# EAGLE design Battery Control (EAGLE 8.4.1)
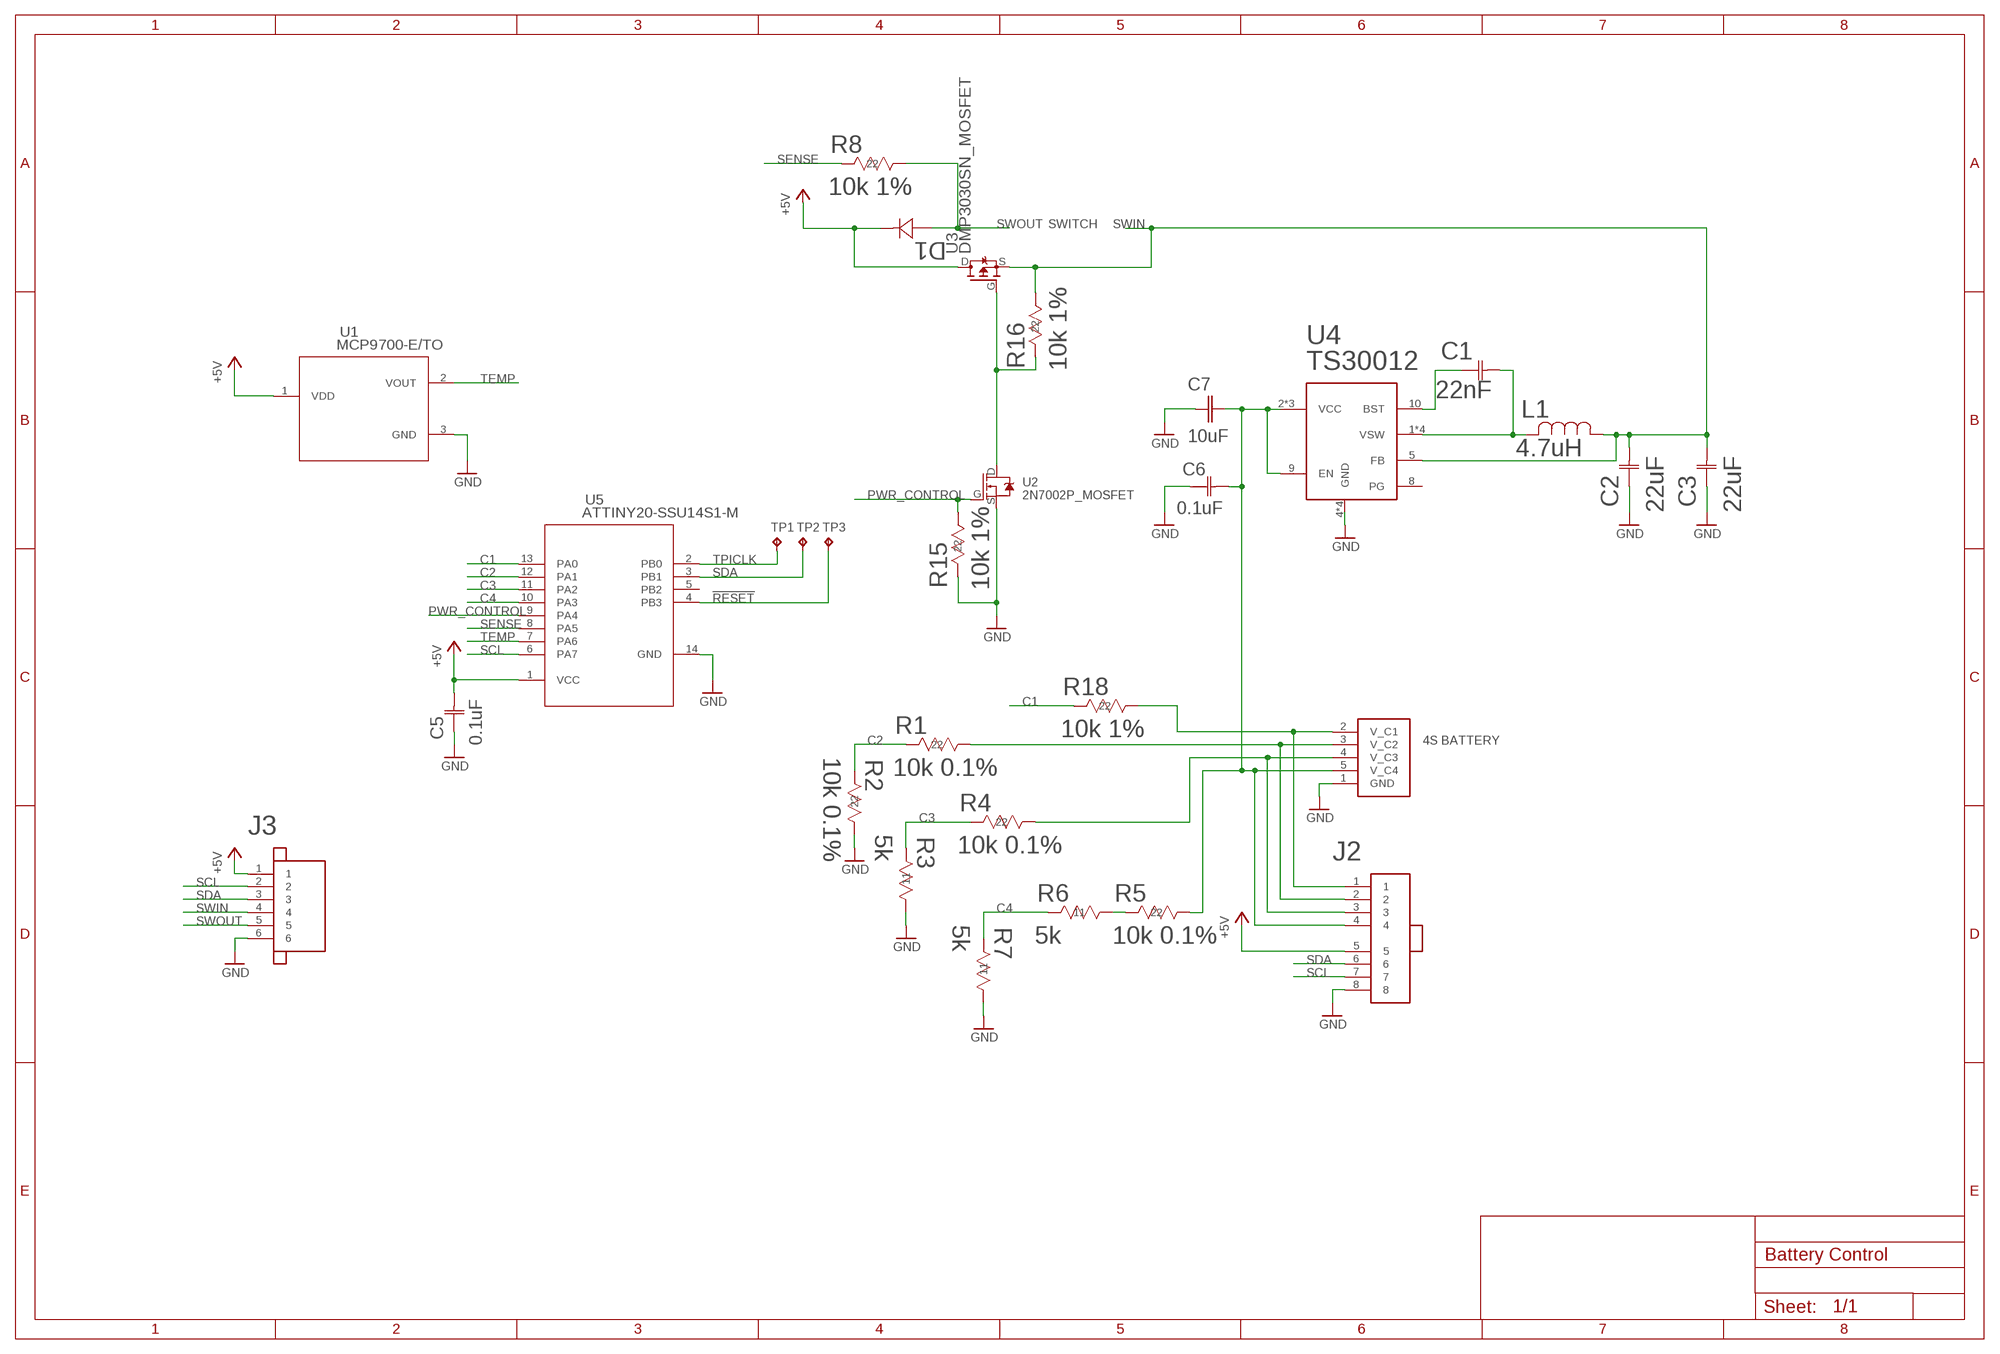
[diagram p0: schematic, sheet 1]

## Parts
C1  22nF  GRM155R71H223KA12DG-155-M  [G-155-M]
C2  22uF  GRM21BR60J226ME39L  [G-21]
C3  22uF  GRM21BR60J226ME39L  [G-21]
C5  0.1uF  08055C104KAT2A  [0805]
C6  0.1uF  08055C104KAT2A  [0805]
C7  10uF  10UF_CAPACITOR  [1206_MLCC]
D1  1N4148W-7-FSOD123-M  [SOD123-M]
J1  JST-XH_5POS  [JST-XH_5POS]
J2  SPRING_BTB_8POS_FEMALE  [SPRING_BTB_8POS_FEMALE]
J3  JST_SH_6POS_SIDE  [JST_SH_6POS_SIDE]
L1  4.7uH  DFE252012P-4R7M=P2"  [1008]
R1  10k 0.1%  ERA-6AEB103V  [RC0805N]
R2  10k 0.1%  ERA-6AEB103V  [RC0805N]
R3  5k  PNM0402E5001BST1  [0402]
R4  10k 0.1%  ERA-6AEB103V  [RC0805N]
R5  10k 0.1%  ERA-6AEB103V  [RC0805N]
R6  5k  PNM0402E5001BST1  [0402]
R7  5k  PNM0402E5001BST1  [0402]
R8  10k 1%  ERA-6AEB103V  [RC0805N]
R15  10k 1%  ERA-6AEB103V  [RC0805N]
R16  10k 1%  ERA-6AEB103V  [RC0805N]
R18  10k 1%  ERA-6AEB103V  [RC0805N]
TP1  TPB2,54  [B2,54]
TP2  TPB2,54  [B2,54]
TP3  TPB2,54  [B2,54]
U1  MCP9700-E/TO  [TO-92_MC]
U2  2N7002P_MOSFET  [SOT-23_(TO-236AB)]
U3  DMP3030SN_MOSFET  [SC59_MOSFET]
U4  TS30012  [16-VQFN]
U5  ATTINY20-SSU14S1-M  [14S1-M]

## Nets
!RESET: TP3.TP U5.4(PB3)
+5V: C5.2 D1.C J2.5 J3.1 U1.1(VDD) U3.D U5.1(VCC)
C1: R18.2 U5.13(PA0)
C2: R1.2 R2.2 U5.12(PA1)
C3: R3.1 R4.2 U5.11(PA2)
C4: R6.1 R7.1 U5.10(PA3)
GND: C2.1 C3.1 C5.1 C6.1 C7.P$1 J1.1(GND) J2.8 J3.6 R2.1 R3.2 R7.2 R15.2 U1.3(GND) U2.S U4.4(GND) U4.14(GND) U4.15(GND) U4.17(GND) U5.14(GND)
N$1: R16.2 U2.D U3.G
N$2: C1.1 U4.10(BST)
N$3: C1.2 L1.P$2 U4.1(VSW) U4.12(VSW) U4.13(VSW) U4.16(VSW)
N$8: J1.2(V_C1) J2.1 R18.1
N$10: J1.3(V_C2) J2.2 R1.1
N$13: J1.4(V_C3) J2.3 R4.1
N$14: R5.2 R6.2
N$16: C6.2 C7.P$2 J1.5(V_C4) J2.4 R5.1 U4.2(VCC) U4.3(VCC) U4.9(EN) U4.11(VCC)
PWR_CONTROL: R15.1 U2.G U5.9(PA4)
SCL: J2.7 J3.2 U5.6(PA7)
SDA: J2.6 J3.3 TP2.TP U5.3(PB1)
SENSE: R8.2 U5.8(PA5)
SWIN: C2.2 C3.2 J3.4 L1.P$1 R16.1 U3.S U4.5(FB)
SWOUT: D1.A J3.5 R8.1
TEMP: U1.2(VOUT) U5.7(PA6)
TPICLK: TP1.TP U5.2(PB0)
Unconnected: U4.8(PG) U5.5(PB2)

## Notes on the sheet
- SWITCH

## Library data of the parts
C1 = 22nF-capacitor:GRM155R71H223KA12D; MANUFACTURER_PART_NUMBER: GRM155R71H223KA12D; VENDOR: Murata
C2 C3 = 22uF X5R Ceramic Capacitor:GRM21BR60J226ME39L; COPYRIGHT: Copyright C 2015 Accelerated Designs. All rights reserved; MANUFACTURER_PART_NUMBER: GRM21BR60J226ME39L; VENDOR: Vendor
C5 C6 = 0.1uF X7R Ceramic Capacitor:08055C104KAT2A; COPYRIGHT: Copyright C 2015 Accelerated Designs. All rights reserved; MANUFACTURER_PART_NUMBER: 08055C104KAT2A; VENDOR: Vendor
C7 = thanics_robotics:10UF_CAPACITOR
D1 = 1n4148w-diode:1N4148W-7-F; COPYRIGHT: Copyright C 2015 Accelerated Designs. All rights reserved; MANUFACTURER_PART_NUMBER: 1N4148W7F; VENDOR: Diodes Inc
J1 = thanics_robotics:JST-XH_5POS
J2 = thanics_robotics:SPRING_BTB_8POS_FEMALE
J3 = thanics_robotics:JST_SH_6POS_SIDE
L1 = 4.7uH-inductor:DFE252012P-4R7M=P2
R1 R2 R4 R5 R8 R15 R16 R18 = 10k-resistor:ERA-6AEB103V; CASE: 0805 2012 metric; COMPOSITION: Thin Film; COPYRIGHT: Copyright C 2015 Accelerated Designs. All rights reserved; DATASHEET: httpindustrial.panasonic.comwwwcgijvcr13pz.cgi?E+PZ+3+AOA0026+ERA6AEB103V+7+WW; DIGIKEYPARTNUMBER: P10KDATRND; HEIGHT: 0.024" 0.60mm; LEADSTYLE: Surface Mount SMD SMT; MANUFACTURER_PART_NUMBER: ERA6AEB103V; NUMBEROFTERMINATIONS: 2; PACKAGECASE: 0805 2012 Metric; PACKAGING: Tape &amp Reel TR; POWERWATTS: 0.125W 18W; QUANTITY_AVAILABLE: 225000; RESISTANCEINOHMS: 10.0K; RESISTANCEOHMS: 10K; SIZEDIMENSION: 0.079" L x 0.049" W 2.00mm x 1.25mm; TEMPERATURECOEFFICIENT: 25ppm°C; TOLERANCE: 0.1%; VENDOR: Panasonic; VOLTAGEWORKING: 100V
R3 R6 R7 = 5k-resistor:PNM0402E5001BST1; COPYRIGHT: Copyright C 2015 Accelerated Designs. All rights reserved; MANUFACTURER_PART_NUMBER: PNM0402E5001BST1; VENDOR: Vendor
TP1-TP3 = testpad:TP: Test pad
U1 = mcp9700-temp:MCP9700-E/TO; MANUFACTURER_PART_NUMBER: MCP9700ETO; VENDOR: Microchip
U2 = thanics_robotics:2N7002P_MOSFET
U3 = thanics_robotics:DMP3030SN_MOSFET
U4 = thanics_robotics:TS30012
U5 = attiny20:ATTINY20-SSU; MANUFACTURER_PART_NUMBER: ATTINY20SSU; VENDOR: Atmel

## Board
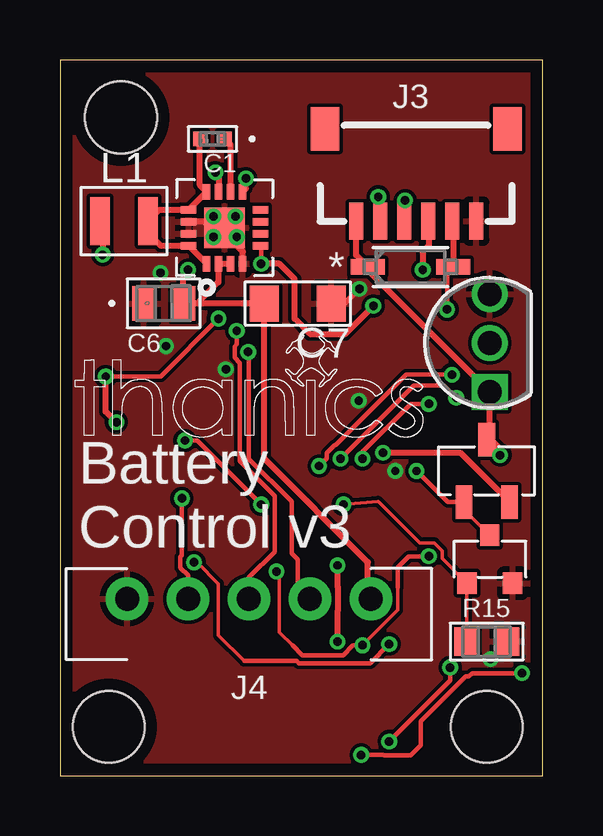
[diagram p1: board, top side]
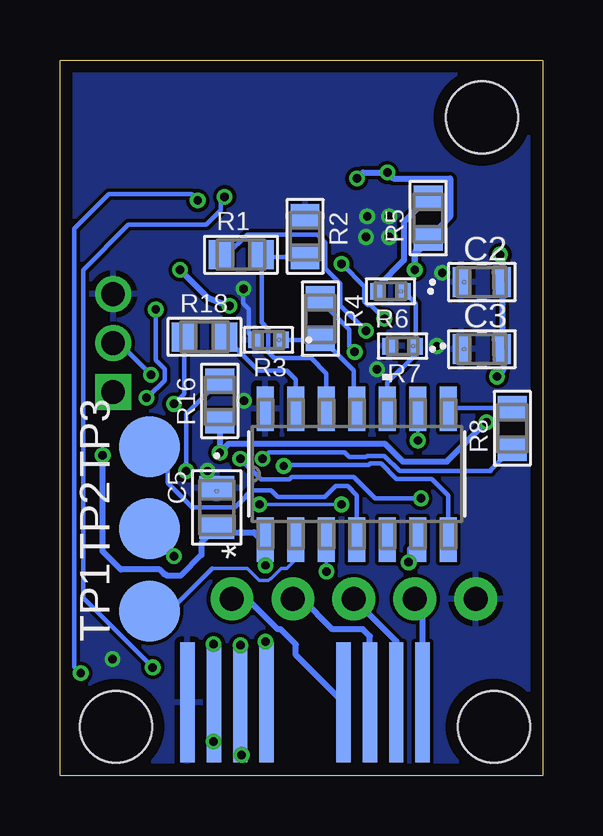
[diagram p2: board, bottom side, seen from below]

Size 20.12 x 29.84 mm. Coordinates in mm from the lower left corner, seen from the top.
Outline: 0,0 20.12,0 20.12,29.84 0,29.84 0,0
Copper layers (1*16): Top 0.035mm / dielectric 1.6mm / Bottom 0.035mm
Design rules "Elecrow_2-layer_PCB_eagle_rule": minimum track width 6mil, minimum drill 12mil, track to track 6mil, track to pad 6mil, pad to pad 6mil, via to via 8mil, smd to smd 0mil, copper to edge 20mil, drill to drill 10mil, minimum pad ring 6mil, minimum via ring 6mil, stop-mask expansion 0mil, vias tented up to drill 100mil, thermal gap 10mil
Holes 3 mm at 17.78,2.03 2.03,2.03 2.54,27.43

### Footprints (pad centres in the part's own frame; a part is rotated, then mirrored left to right if it is on the bottom)
G-155-M = smd 0.559 x 0.61: 1 -0.521,0; 2 0.521,0
G-21 = smd 0.711 x 1.245: 1 -0.851,0; 2 0.851,0
0805 = smd 0.965 x 1.448: 1 -0.826,0; 2 0.826,0
1206_MLCC = smd 1.2 x 1.5: P$1 -1.4,0; P$2 1.4,0
SOD123-M = smd 1.416 x 0.652: A 1.776,0; C -1.776,0
JST-XH_5POS = drill 1 pad 1.778: 1 0,5.08; 2 0,2.54; 3 0,0; 4 0,-2.54; 5 0,-5.08
SPRING_BTB_8POS_FEMALE = smd 0.6 x 5: 1 -4.9,0; 2 -3.8,0; 3 -2.7,0; 4 -1.6,0; 5 1.6,0; 6 2.7,0; 7 3.8,0; 8 4.9,0
JST_SH_6POS_SIDE = smd 0.6 x 1.55: 1 -1.5,0; 2 -0.5,0; 3 0.5,0; 4 1.5,0; 5 2.5,0; 6 3.5,0 | smd 1.2 x 1.8: P$5 -2.8,3.85; P$6 4.8,3.85
1008 = smd 0.8 x 2: P$1 -1,0; P$2 1,0
RC0805N = smd 1.006 x 1.2: 1 -0.853,0; 2 0.853,0
0402 = smd 0.584 x 0.686: 1 -0.546,0; 2 0.546,0
B2,54 = smd 2.54 x 2.54: TP 0,0
TO-92_MC = drill 0.991 pad 1.499 square: 1 -3.31,0 | drill 0.991 pad 1.499: 2 -1.27,0; 3 0.77,0
SOT-23_(TO-236AB) = smd 0.8 x 0.9: D 0,-1; G 0.95,1; S -0.95,1
SC59_MOSFET = smd 0.7 x 1.4: D 0,1.3; G -0.95,-1.3; S 0.95,-1.3
16-VQFN = smd 0.3 x 0.65: 1 -0.75,-1.27; 2 -0.25,-1.27; 3 0.25,-1.27; 4 0.75,-1.27; 9 0.75,1.73; 10 0.25,1.73; 11 -0.25,1.73; 12 -0.75,1.73 | smd 0.65 x 0.3: 5 1.5,-0.52; 6 1.5,-0.02; 7 1.5,0.48; 8 1.5,0.98; 13 -1.5,0.98; 14 -1.5,0.48; 15 -1.5,-0.02; 16 -1.5,-0.52 | smd 1.7 x 1.7: 17 0,0.23
14S1-M = smd 1.854 x 0.711: 1 -2.731,3.81; 2 -2.731,2.54; 3 -2.731,1.27; 4 -2.731,0; 5 -2.731,-1.27; 6 -2.731,-2.54; 7 -2.731,-3.81; 8 2.731,-3.81; 9 2.731,-2.54; 10 2.731,-1.27; 11 2.731,0; 12 2.731,1.27; 13 2.731,2.54; 14 2.731,3.81

### Placement (x,y rotation side)
C1  6.35,26.54 180 top
C2  2.54,20.57 0 bottom
C3  2.54,17.78 0 bottom
C5  13.59,11.18 270 bottom
C6  4.32,19.69 0 top
C7  9.91,19.69 180 top
D1  14.61,21.21 0 top
J1  7.87,7.37 90 top
J2  9.91,3.05 180 bottom
J3  13.84,23.11 0 top
L1  2.67,23.11 0 top
R1  12.57,21.72 0 bottom
R2  9.91,22.48 270 bottom
R3  11.43,18.16 180 bottom
R4  9.27,19.05 270 bottom
R5  4.78,23.24 90 bottom
R6  6.35,20.19 180 bottom
R7  5.84,17.91 180 bottom
R8  1.27,14.48 90 bottom
R15  17.78,5.59 0 top
R16  13.46,15.62 90 bottom
R18  14.1,18.29 0 bottom
TP1  16.38,6.86 90 bottom
TP2  16.38,10.29 90 bottom
TP3  16.38,13.72 90 bottom
U1  17.91,19.3 90 top
U2  17.91,9.02 180 top
U3  17.78,12.7 0 top
U4  6.86,22.61 0 top
U5  7.75,12.57 90 bottom

### Tracks (layer width: path | path; a pad name or v marks a point on that pad's centre or on a via)
!RESET
  Bottom 0.178: TP3.TP 15.62,12.95 15.62,12.19 14.61,11.18 12.83,11.18 12.38,11.62 12.38,11.67 12.15,11.9 11.32,11.9 11.05,11.62 9.08,11.62 8.64,12.07 8.13,12.07 7.75,11.68 U5.4
+5V  (via drill 0.35)
  Top 0.254: 17.87,14.09 17.91,14.13 U1.1 12.83,21.07 D1.C 12.34,21.7 J3.1 | 17.87,14.09 U3.D | v11.56,8.76 11.56,7.88 11.58,7.85 11.58,6.88 11.56,6.86 v11.56,5.59 | v18.34,13.36 18.34,13.61 17.87,14.09
  Bottom 0.152: J2.5 11.56,3.1 11.56,4.42 | v11.56,8.76 11.56,9.7 U5.1 11.86,10.14
  Bottom 0.254: 12.04,10.14 13.38,10.14 C5.2 14.22,9.71 14.22,9.2 15.09,8.33 15.67,8.33 15.74,8.41 15.77,8.41 15.95,8.59 17.58,8.59 18.34,9.35 v18.34,13.36 | 12.04,10.14 11.86,10.14 | 12.04,10.14 11.6,9.7 11.56,9.7 | U5.1 v11.56,8.76 | v11.56,5.59 11.56,4.42
C1
  Bottom 0.178: R18.2 11.85,16.89 10.67,16.89 10.29,16.51 U5.13
C2
  Bottom 0.178: U5.12 9.02,16.76 9.65,17.4 11.19,17.4 11.44,17.65 11.44,18.6 11.72,18.88 R1.2 11.63,21.63 R2.2
C3
  Bottom 0.178: U5.11 7.87,15.43 7.87,16.89 9.18,18.2 R4.2 9.31,18.16 R3.1
C4
  Bottom 0.178: U5.10 6.48,16.38 5.3,17.56 R7.1 5.3,19.69 R6.1
GND  (via drill 0.35)
  Top 0.178: v17.93,4.85 18.63,5.55 R15.2
  Top 0.254: U4.14 5.39,23.11 5.97,23.11 6.25,22.84 U4.17 | U4.4 7.62,21.35 7.62,21.84 7.37,22.1 v7.37,22.45 | v12.47,20.3 11.86,19.69 C7.P$1
  Bottom 0.178: R3.2 12.24,18.43 12.24,19.46 12.47,19.69 v12.47,20.3
  other vias: 12.45,15.62 13.97,12.7 4.19,20.95 6.4,23.32 7.32,23.32 6.4,22.45 6.91,16.94 4.42,17.91
  pour Bottom: 0,29.84 20.07,29.84 20.07,0 0,0
  pour Top: 0,29.84 20.07,29.84 20.07,0 0,0
N$1  (via drill 0.35)
  Top 0.152: U2.D 16.83,11.09 U3.G
  Top 0.178: v14.86,12.7 16.16,11.4 U3.G
  Bottom 0.178: R16.2 14.86,15.08 v14.86,12.7
N$2
  Top 0.254: U4.10 7.11,26.31 C1.1
N$3
  Top 0.254: 6.08,24.37 U4.12 | 6.08,24.37 5.83,24.62 C1.2 | 6.08,24.37 6.08,24.31 U4.13 4.14,23.59 L1.P$2 3.67,22.62 4.2,22.09 U4.16 U4.1
N$8  (via drill 0.35)
  Top 0.178: J1.2 5.33,8.34 5.02,8.65 5.02,9.13 5.08,9.19 v5.08,11.56 | v12.6,13.21 12.6,13.49 14.61,15.49 v15.37,15.49
  Bottom 0.178: v5.08,11.56 6.98,11.56 7.87,12.45 10.45,12.45 10.56,12.34 11.73,12.34 v12.6,13.21 | v15.37,15.49 14.95,15.91 R18.1
  Bottom 0.254: J2.1 5.01,7.04 J1.2
N$10  (via drill 0.35)
  Top 0.178: v7.37,18.54 7.37,17.99 7.27,17.9 7.27,17.43 7.49,17.2 7.49,13.12 8.95,11.66 8.95,9.33 7.87,8.25 J1.3
  Bottom 0.178: v7.37,18.54 8.43,19.61 8.43,20.51 9.07,21.14 9.07,22.23 9.39,22.56 12.32,22.56 13.16,21.72 R1.1
  Bottom 0.254: J2.2 6.11,5.6 J1.3
N$13  (via drill 0.35)
  Top 0.178: J1.4 9.91,7.87 9.91,9.02 9.65,9.27 9.65,11.43 7.87,13.21 7.87,17.63 v7.84,17.66
  Bottom 0.178: R4.1 9.27,19.81 8.07,18.6 8.07,17.89 v7.84,17.66
  Bottom 0.254: J2.3 7.21,5.81 7.49,6.1 8.76,6.1 10.03,7.37 J1.4
N$14
  Bottom 0.178: R6.2 7.11,20.41
  Bottom 0.254: R5.2 5.79,23.08 5.79,21.48 6.87,20.41 7.07,20.41 6.9,20.23 R6.2
N$16  (via drill 0.35)
  Top 0.254: U4.2 | U4.2 6.6,20.57 5.71,19.69 C6.2 | U4.3 U4.2 | C6.2 C7.P$2 8.51,13.21 12.83,8.89 12.83,7.49 J1.5 | U4.11 6.61,25.02 v6.48,25.15 | v7.75,24.89 7.75,24.48 U4.9 | C6.2 5.14,20.89 v5.33,21.08
  Bottom 0.254: J2.4 10.29,5.03 10.29,5.46 10.92,6.1 11.05,6.1 12.32,7.37 J1.5 | v7.75,24.89 7.49,25.15 v6.48,25.15 6.22,24.89 3.86,24.89 3.86,23.3 R5.1 | R5.1 4.85,22.29 5.33,21.68 v5.33,21.08 5.33,21.83 R5.1
PWR_CONTROL  (via drill 0.35)
  Top 0.152: R15.1 16.96,5.62 U2.G 15.92,9.05 15.92,9.37 15.6,9.7 14.99,9.7 13.26,11.43 v11.81,11.3
  Top 0.178: v8.38,11.3 5.71,13.97 v5.21,13.97
  Bottom 0.152: v5.21,13.97 U5.9 | v11.81,11.3 v8.38,11.3
SCL  (via drill 0.35)
  Top 0.152: v5.59,8.89 5.71,8.89 6.6,8 6.6,5.84 7.67,4.77
  Top 0.178: 7.67,4.77 9.87,4.77 9.96,4.69 12.92,4.69 v13.72,5.49 | v13.72,1.42 16.26,3.96 v16.26,4.51 | v13.26,24.13 13.26,23.2 J3.2
  Bottom 0.152: U5.6 5.59,9.46 v5.59,8.89
  Bottom 0.178: v13.72,5.49 J2.7 v13.71,1.43 v13.72,1.42 | v16.26,4.51 19.15,7.4 19.15,21.08 17.27,22.96 14.02,22.96 13.41,23.57 13.41,23.98 v13.26,24.13
SDA  (via drill 0.35)
  Top 0.152: v9.02,8.51 9.14,8.38 9.14,5.97 9.69,5.42 | 14.07,7.85 14.07,6.9 v12.6,5.43
  Top 0.178: v15.37,9.14 14.53,9.14 14.07,8.69 14.07,7.85 | v12.6,5.43 12.21,5.43 11.79,5.02 10.09,5.02 9.69,5.42 | v12.55,0.86 13.47,0.86 13.48,0.85 14.62,0.85 15.04,1.27 15.04,2.25 16.91,4.13 17.03,4.13 17.17,4.27 v19.25,4.27 | v14.38,23.98 14.38,23.15 J3.3
  Bottom 0.152: U5.3 v9.02,8.51 | TP2.TP 15.37,9.27 v15.37,9.14
  Bottom 0.178: v12.6,5.43 v12.61,5.43 J2.6 12.61,0.92 v12.55,0.86 | v19.25,4.27 19.52,4.53 19.52,22.8 18.08,24.23 14.63,24.23 v14.38,23.98
SENSE
  Bottom 0.178: R8.2 3.91,15.33 U5.8
SWIN  (via drill 0.35)
  Top 0.178: U4.5 8.38,22.06 v8.38,21.34 | v6.6,19.05 4.19,16.64 v1.9,16.64
  Top 0.254: U3.S 16.67,13.46 v13.46,13.46 | L1.P$1 1.78,23 v1.78,21.72 | J3.4 15.37,23.09 15.37,22.1 15.11,21.84 v15.11,21.08 | v8.38,21.34 9.14,21.34 9.78,20.7 9.78,19.05 10.41,18.41 11.89,18.41 v13.06,19.58 | v2.35,14.73 1.9,15.18 v1.9,16.64
  Bottom 0.178: v8.38,21.34 7.44,20.4 7.44,19.76 7.29,19.61 7.16,19.61 v6.6,19.05
  Bottom 0.254: R16.1 v13.46,13.46 13.08,13.84 6.59,13.84 5.84,13.09 3.99,13.09 v2.35,14.73 | v1.78,21.72 1.69,21.63 C2.2 C3.2 1.65,17.74 1.65,16.89 v1.9,16.64 | v15.11,21.08 13.97,19.94 v13.06,19.58
SWOUT  (via drill 0.35)
  Top 0.178: D1.A 16.13,20.96 v16.13,19.43 | v16.51,15.75 16.49,15.75 15.98,16.26 14.73,16.26 v11.68,13.21
  Top 0.254: J3.5 16.38,23.08 D1.A
  Bottom 0.178: R8.1 2.16,12.74 2.16,12.7 5.97,12.7 6.6,13.34 7.32,13.34 7.38,13.27 8.05,13.27 8.26,13.48 11.42,13.48 v11.68,13.21 | v16.51,15.75 16.11,16.14 16.09,16.14 15.76,16.48 15.76,16.95 16.13,17.31 v16.13,19.43
TEMP  (via drill 0.35)
  Top 0.178: v10.79,12.91 11.12,13.23 11.12,13.44 11.45,13.78 11.49,13.78 14.43,16.71 v16.33,16.71
  Bottom 0.178: U5.7 3.94,11.68 4.62,12.37 6.11,12.37 6.74,13.01 7.19,13.01 7.25,12.94 10.76,12.94 v10.79,12.91 | v16.33,16.71 17.65,18.03 U1.2
TPICLK
  Bottom 0.152: 13.77,8.64 12.32,8.64 11.81,8.13 11.43,8.13 11.35,8.21 11.33,8.21 10.9,8.64 10.67,8.64 10.29,9.02 U5.2
  Bottom 0.178: TP1.TP 15.54,6.86 13.77,8.64

### Text on the board
tPlace: Battery / Control v3
tNames: J3 | J4